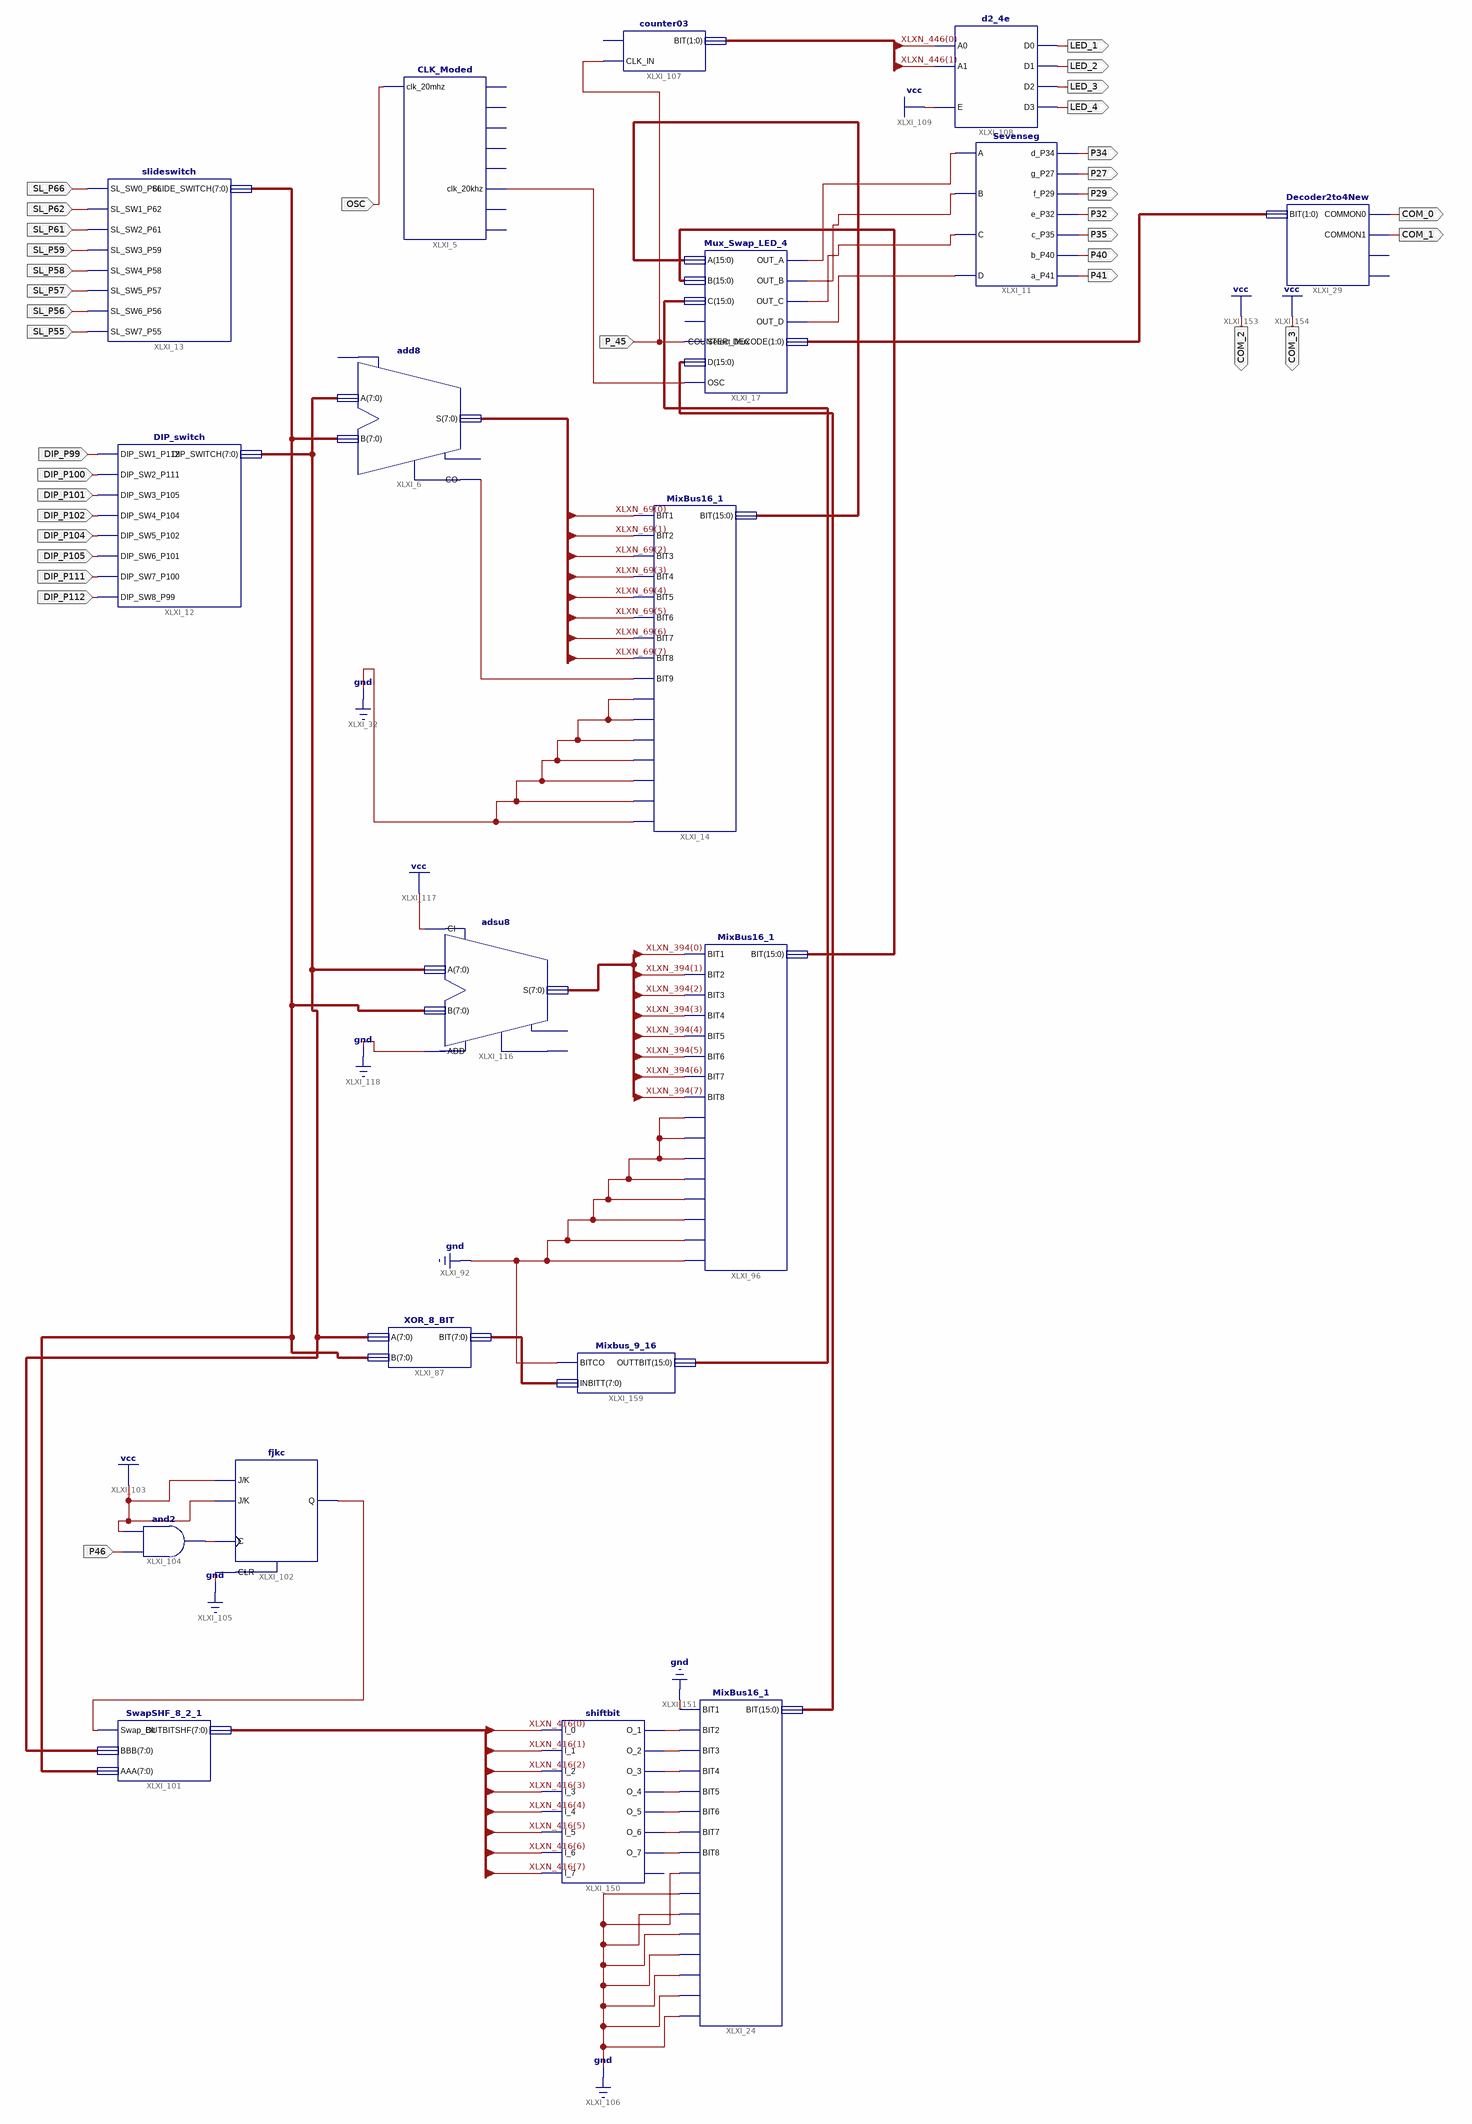
[diagram p0: schematic sheet 1]
// Xilinx ISE schematic Lab9.sch (spartan6) as structural Verilog: 19 symbols, 34 ports
module Lab9 (
  input  OSC,
  input  DIP_P99,
  input  DIP_P100,
  input  DIP_P101,
  input  DIP_P102,
  input  DIP_P104,
  input  DIP_P105,
  input  DIP_P111,
  input  DIP_P112,
  input  SL_P55,
  input  SL_P56,
  input  SL_P57,
  input  SL_P58,
  input  SL_P59,
  input  SL_P61,
  input  SL_P62,
  input  SL_P66,
  input  P46,
  input  P_45,
  output P34,
  output P27,
  output P29,
  output P32,
  output P35,
  output P40,
  output P41,
  output COM_0,
  output COM_1,
  output LED_1,
  output LED_2,
  output LED_3,
  output LED_4,
  output COM_2,
  output COM_3
);

  wire XLXN_4, XLXN_67, XLXN_86, XLXN_87, XLXN_88, XLXN_92, XLXN_429, XLXN_430, XLXN_610, XLXN_611, XLXN_612,
       XLXN_613, XLXN_614, XLXN_615, XLXN_616;
  wire [1:0] XLXN_128, XLXN_446;
  wire [7:0] XLXN_69, XLXN_351, XLXN_369, XLXN_394, XLXN_416, XLXN_619;
  wire [15:0] XLXN_78, XLXN_93, XLXN_349, XLXN_621;

  CLK_Moded XLXI_5 (
    .clk_20mhz(OSC), .clk_20khz(XLXN_92));  // open: clk_2mhz, clk_200khz, clk_2khz, clk_200hz, clk_2hz, clk_20hz, clk_1hz
  add8 XLXI_6 (.A(XLXN_369), .B(XLXN_351), .CO(XLXN_67), .S(XLXN_69));  // open: CI, OFL
  Sevenseg XLXI_11 (
    .D(XLXN_4), .C(XLXN_88), .B(XLXN_87), .A(XLXN_86), .a_P41(P41), .b_P40(P40), .c_P35(P35), .e_P32(P32),
    .f_P29(P29), .g_P27(P27), .d_P34(P34));
  MixBus16_1 XLXI_14 (
    .BIT1(XLXN_69[0]), .BIT2(XLXN_69[1]), .BIT3(XLXN_69[2]), .BIT4(XLXN_69[3]), .BIT5(XLXN_69[4]),
    .BIT6(XLXN_69[5]), .BIT7(XLXN_69[6]), .BIT8(XLXN_69[7]), .BIT9(XLXN_67), .BIT10(1'b0), .BIT11(1'b0),
    .BIT12(1'b0), .BIT13(1'b0), .BIT14(1'b0), .BIT15(1'b0), .BIT16(1'b0), .BIT(XLXN_78));
  Decoder2to4New XLXI_29 (.BIT(XLXN_128), .COMMON0(COM_0), .COMMON1(COM_1));  // open: COMMON2, COMMON3
  DIP_switch XLXI_12 (
    .DIP_SW1_P112(DIP_P99), .DIP_SW2_P111(DIP_P100), .DIP_SW3_P105(DIP_P101), .DIP_SW4_P104(DIP_P102),
    .DIP_SW5_P102(DIP_P104), .DIP_SW6_P101(DIP_P105), .DIP_SW7_P100(DIP_P111), .DIP_SW8_P99(DIP_P112),
    .DIP_SWITCH(XLXN_369));
  MixBus16_1 XLXI_24 (
    .BIT1(1'b0), .BIT2(XLXN_610), .BIT3(XLXN_611), .BIT4(XLXN_612), .BIT5(XLXN_613), .BIT6(XLXN_614),
    .BIT7(XLXN_615), .BIT8(XLXN_616), .BIT9(1'b0), .BIT10(1'b0), .BIT11(1'b0), .BIT12(1'b0), .BIT13(1'b0),
    .BIT14(1'b0), .BIT15(1'b0), .BIT16(1'b0), .BIT(XLXN_349));
  XOR_8_BIT XLXI_87 (.A(XLXN_369), .B(XLXN_351), .BIT(XLXN_619));
  slideswitch XLXI_13 (
    .SL_SW0_P66(SL_P66), .SL_SW1_P62(SL_P62), .SL_SW2_P61(SL_P61), .SL_SW3_P59(SL_P59), .SL_SW4_P58(SL_P58),
    .SL_SW5_P57(SL_P57), .SL_SW6_P56(SL_P56), .SL_SW7_P55(SL_P55), .SLIDE_SWITCH(XLXN_351));
  MixBus16_1 XLXI_96 (
    .BIT1(XLXN_394[0]), .BIT2(XLXN_394[1]), .BIT3(XLXN_394[2]), .BIT4(XLXN_394[3]), .BIT5(XLXN_394[4]),
    .BIT6(XLXN_394[5]), .BIT7(XLXN_394[6]), .BIT8(XLXN_394[7]), .BIT9(1'b0), .BIT10(1'b0), .BIT11(1'b0),
    .BIT12(1'b0), .BIT13(1'b0), .BIT14(1'b0), .BIT15(1'b0), .BIT16(1'b0), .BIT(XLXN_93));
  SwapSHF_8_2_1 XLXI_101 (.Swap_Bit(XLXN_429), .BBB(XLXN_369), .AAA(XLXN_351), .OUTBITSHF(XLXN_416));
  fjkc XLXI_102 (.C(XLXN_430), .CLR(1'b0), .J(1'b1), .K(1'b1), .Q(XLXN_429));
  and XLXI_104 (XLXN_430, P46, 1'b1);
  counter03 XLXI_107 (.CLK_IN(P_45), .BIT(XLXN_446));  // open: CLR_IN
  adsu8 XLXI_116 (.A(XLXN_369), .ADD(1'b0), .B(XLXN_351), .CI(1'b1), .S(XLXN_394));  // open: CO, OFL
  d2_4e XLXI_108 (.A0(XLXN_446[0]), .A1(XLXN_446[1]), .E(1'b1), .D0(LED_1), .D1(LED_2), .D2(LED_3), .D3(LED_4));
  Mux_Swap_LED_4 XLXI_17 (
    .A(XLXN_78), .B(XLXN_93), .C(XLXN_621), .COUNTER_DECODE(XLXN_128), .D(XLXN_349), .OSC(XLXN_92),
    .OUT_A(XLXN_86), .OUT_B(XLXN_87), .OUT_C(XLXN_88), .OUT_D(XLXN_4), .Select_Mux(P_45));  // open: CLR_MUX_CLK
  shiftbit XLXI_150 (
    .I_0(XLXN_416[0]), .I_1(XLXN_416[1]), .I_2(XLXN_416[2]), .I_3(XLXN_416[3]), .I_4(XLXN_416[4]),
    .I_5(XLXN_416[5]), .I_6(XLXN_416[6]), .I_7(XLXN_416[7]), .O_1(XLXN_610), .O_2(XLXN_611), .O_3(XLXN_612),
    .O_4(XLXN_613), .O_5(XLXN_614), .O_6(XLXN_615), .O_7(XLXN_616));  // open: O_0
  Mixbus_9_16 XLXI_159 (.BITCO(1'b0), .INBITT(XLXN_619), .OUTTBIT(XLXN_621));

  assign COM_2 = 1'b1;
  assign COM_3 = 1'b1;
endmodule
